# EAGLE design main_bottom (EAGLE 9.6.2)
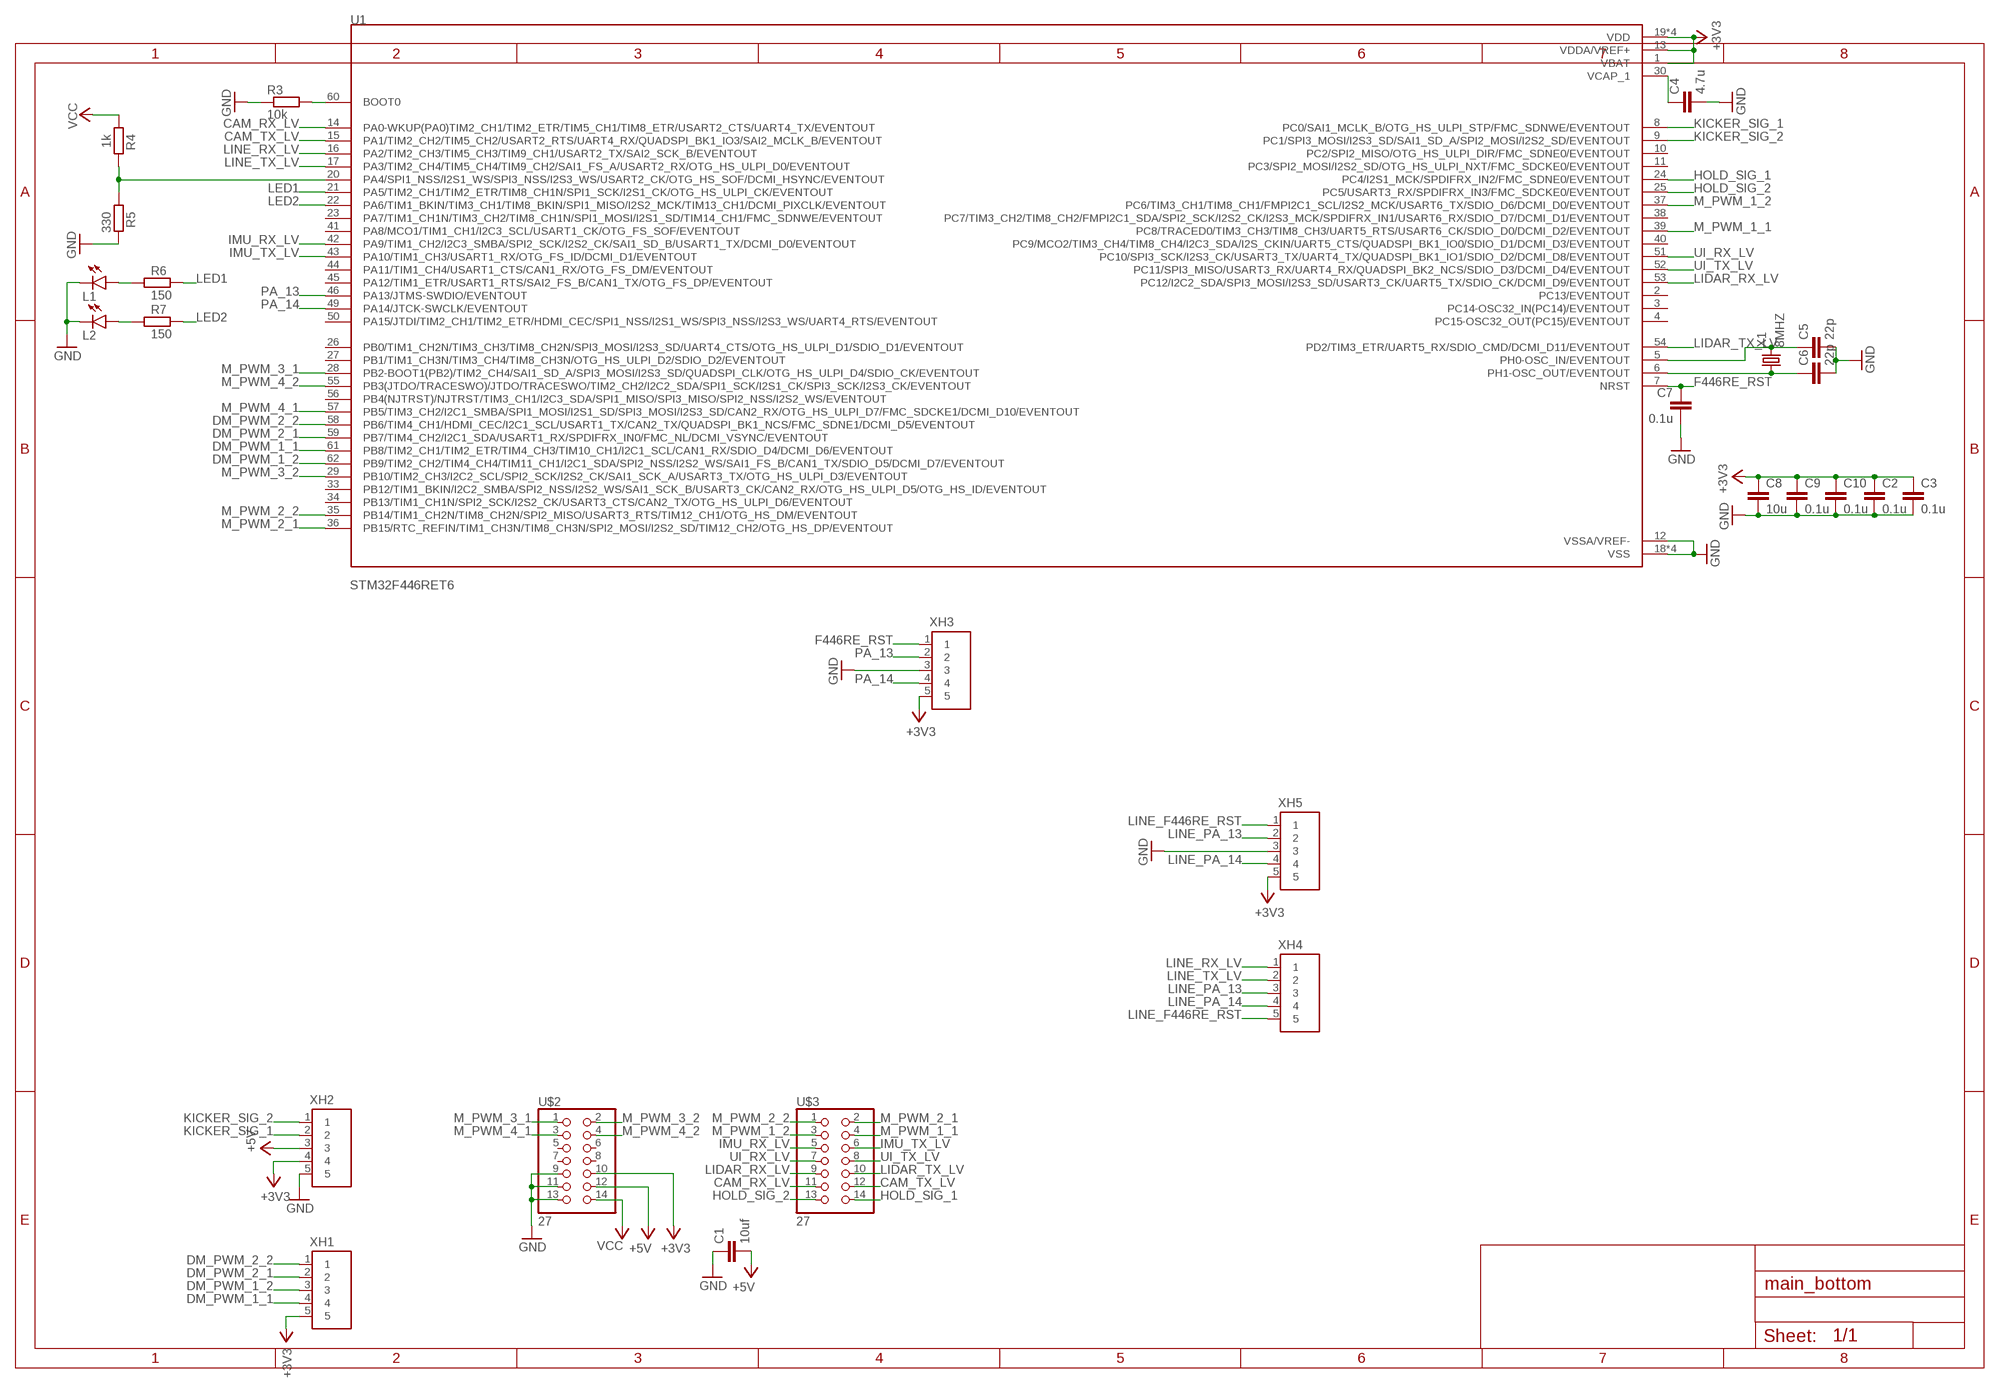
[diagram p0: schematic, sheet 1]

## Parts
C1  10uf  C-EUC0805  [C0805]
C2  0.1u  C-EUC0603  [C0603]
C3  0.1u  C-EUC0603  [C0603]
C4  4.7u  C-EUC0603  [C0603]
C5  22p  C-EUC0603  [C0603]
C6  22p  C-EUC0603  [C0603]
C7  0.1u  C-EUC0603  [C0603]
C8  10u  C-EUC0805  [C0805]
C9  0.1u  C-EUC0603  [C0603]
C10  0.1u  C-EUC0603  [C0603]
L1  SML-E12P8WT86  [LED_SML-LXFM0603SIC-TR]
L2  SML-E12P8WT86  [LED_SML-LXFM0603SIC-TR]
R3  10k  R-EU_R0603  [R0603]
R4  1k  R-EU_R0603  [R0603]
R5  330  R-EU_R0603  [R0603]
R6  150  R-EU_R0603  [R0603]
R7  150  R-EU_R0603  [R0603]
U1  STM32F446RET6  [QFP50P1200X1200X160-64N]
U$2  27  [2*7]
U$3  27  [2*7]
X1  8MHZ  16MHZ  [16MHZ]
XH1  S5B  [S5B]
XH2  S5B  [S5B]
XH3  S5B  [S5B]
XH4  S5B  [S5B]
XH5  S5B  [S5B]

## Nets
+3V3: C2.1 C3.1 C8.1 C9.1 C10.1 U1.1(VBAT) U1.13(VDDA/VREF+) U1.19(VDD) U1.32(VDD) U1.48(VDD) U1.64(VDD) U$2.10 XH1.5 XH2.4 XH3.5 XH5.5
+5V: C1.2 U$2.12 XH2.3
CAM_RX_LV: U1.14(PA0-WKUP(PA0)TIM2_CH1/TIM2_ETR/TIM5_CH1/TIM8_ETR/USART2_CTS/UART4_TX/EVENTOUT) U$3.11
CAM_TX_LV: U1.15(PA1/TIM2_CH2/TIM5_CH2/USART2_RTS/UART4_RX/QUADSPI_BK1_IO3/SAI2_MCLK_B/EVENTOUT) U$3.12
DM_PWM_1_1: U1.61(PB8/TIM2_CH1/TIM2_ETR/TIM4_CH3/TIM10_CH1/I2C1_SCL/CAN1_RX/SDIO_D4/DCMI_D6/EVENTOUT) XH1.4
DM_PWM_1_2: U1.62(PB9/TIM2_CH2/TIM4_CH4/TIM11_CH1/I2C1_SDA/SPI2_NSS/I2S2_WS/SAI1_FS_B/CAN1_TX/SDIO_D5/DCMI_D7/EVENTOUT) XH1.3
DM_PWM_2_1: U1.59(PB7/TIM4_CH2/I2C1_SDA/USART1_RX/SPDIFRX_IN0/FMC_NL/DCMI_VSYNC/EVENTOUT) XH1.2
DM_PWM_2_2: U1.58(PB6/TIM4_CH1/HDMI_CEC/I2C1_SCL/USART1_TX/CAN2_TX/QUADSPI_BK1_NCS/FMC_SDNE1/DCMI_D5/EVENTOUT) XH1.1
F446RE_RST: C7.1 U1.7(NRST) XH3.1
GND: C1.1 C2.2 C3.2 C4.2 C5.2 C6.2 C7.2 C8.2 C9.2 C10.2 L1.C L2.C R3.1 R5.2 U1.12(VSSA/VREF-) U1.18(VSS) U1.31(VSS) U1.47(VSS) U1.63(VSS) U$2.9 U$2.11 U$2.13 XH2.5 XH3.3 XH5.3
HOLD_SIG_1: U1.24(PC4/I2S1_MCK/SPDIFRX_IN2/FMC_SDNE0/EVENTOUT) U$3.14
HOLD_SIG_2: U1.25(PC5/USART3_RX/SPDIFRX_IN3/FMC_SDCKE0/EVENTOUT) U$3.13
IMU_RX_LV: U1.42(PA9/TIM1_CH2/I2C3_SMBA/SPI2_SCK/I2S2_CK/SAI1_SD_B/USART1_TX/DCMI_D0/EVENTOUT) U$3.5
IMU_TX_LV: U1.43(PA10/TIM1_CH3/USART1_RX/OTG_FS_ID/DCMI_D1/EVENTOUT) U$3.6
KICKER_SIG_1: U1.8(PC0/SAI1_MCLK_B/OTG_HS_ULPI_STP/FMC_SDNWE/EVENTOUT) XH2.2
KICKER_SIG_2: U1.9(PC1/SPI3_MOSI/I2S3_SD/SAI1_SD_A/SPI2_MOSI/I2S2_SD/EVENTOUT) XH2.1
LED1: R6.2 U1.21(PA5/TIM2_CH1/TIM2_ETR/TIM8_CH1N/SPI1_SCK/I2S1_CK/OTG_HS_ULPI_CK/EVENTOUT)
LED2: R7.2 U1.22(PA6/TIM1_BKIN/TIM3_CH1/TIM8_BKIN/SPI1_MISO/I2S2_MCK/TIM13_CH1/DCMI_PIXCLK/EVENTOUT)
LIDAR_RX_LV: U1.53(PC12/I2C2_SDA/SPI3_MOSI/I2S3_SD/USART3_CK/UART5_TX/SDIO_CK/DCMI_D9/EVENTOUT) U$3.9
LIDAR_TX_LV: U1.54(PD2/TIM3_ETR/UART5_RX/SDIO_CMD/DCMI_D11/EVENTOUT) U$3.10
LINE_F446RE_RST: XH4.5 XH5.1
LINE_PA_13: XH4.3 XH5.2
LINE_PA_14: XH4.4 XH5.4
LINE_RX_LV: U1.16(PA2/TIM2_CH3/TIM5_CH3/TIM9_CH1/USART2_TX/SAI2_SCK_B/EVENTOUT) XH4.1
LINE_TX_LV: U1.17(PA3/TIM2_CH4/TIM5_CH4/TIM9_CH2/SAI1_FS_A/USART2_RX/OTG_HS_ULPI_D0/EVENTOUT) XH4.2
M_PWM_1_1: U1.39(PC8/TRACED0/TIM3_CH3/TIM8_CH3/UART5_RTS/USART6_CK/SDIO_D0/DCMI_D2/EVENTOUT) U$3.4
M_PWM_1_2: U1.37(PC6/TIM3_CH1/TIM8_CH1/FMPI2C1_SCL/I2S2_MCK/USART6_TX/SDIO_D6/DCMI_D0/EVENTOUT) U$3.3
M_PWM_2_1: U1.36(PB15/RTC_REFIN/TIM1_CH3N/TIM8_CH3N/SPI2_MOSI/I2S2_SD/TIM12_CH2/OTG_HS_DP/EVENTOUT) U$3.2
M_PWM_2_2: U1.35(PB14/TIM1_CH2N/TIM8_CH2N/SPI2_MISO/USART3_RTS/TIM12_CH1/OTG_HS_DM/EVENTOUT) U$3.1
M_PWM_3_1: U1.28(PB2-BOOT1(PB2)/TIM2_CH4/SAI1_SD_A/SPI3_MOSI/I2S3_SD/QUADSPI_CLK/OTG_HS_ULPI_D4/SDIO_CK/EVENTOUT) U$2.1
M_PWM_3_2: U1.29(PB10/TIM2_CH3/I2C2_SCL/SPI2_SCK/I2S2_CK/SAI1_SCK_A/USART3_TX/OTG_HS_ULPI_D3/EVENTOUT) U$2.2
M_PWM_4_1: U1.57(PB5/TIM3_CH2/I2C1_SMBA/SPI1_MOSI/I2S1_SD/SPI3_MOSI/I2S3_SD/CAN2_RX/OTG_HS_ULPI_D7/FMC_SDCKE1/DCMI_D10/EVENTOUT) U$2.3
M_PWM_4_2: U1.55(PB3(JTDO/TRACESWO)/JTDO/TRACESWO/TIM2_CH2/I2C2_SDA/SPI1_SCK/I2S1_CK/SPI3_SCK/I2S3_CK/EVENTOUT) U$2.4
N$5: C4.1 U1.30(VCAP_1)
N$7: R3.2 U1.60(BOOT0)
N$8: C5.1 U1.5(PH0-OSC_IN/EVENTOUT) X1.P$2
N$10: C6.1 U1.6(PH1-OSC_OUT/EVENTOUT) X1.P$1
N$13: L2.A R7.1
N$14: L1.A R6.1
PA_13: U1.46(PA13/JTMS-SWDIO/EVENTOUT) XH3.2
PA_14: U1.49(PA14/JTCK-SWCLK/EVENTOUT) XH3.4
UI_RX_LV: U1.51(PC10/SPI3_SCK/I2S3_CK/USART3_TX/UART4_TX/QUADSPI_BK1_IO1/SDIO_D2/DCMI_D8/EVENTOUT) U$3.7
UI_TX_LV: U1.52(PC11/SPI3_MISO/USART3_RX/UART4_RX/QUADSPI_BK2_NCS/SDIO_D3/DCMI_D4/EVENTOUT) U$3.8
VCC: R4.1 U$2.14
VCC_SIG: R4.2 R5.1 U1.20(PA4/SPI1_NSS/I2S1_WS/SPI3_NSS/I2S3_WS/USART2_CK/OTG_HS_SOF/DCMI_HSYNC/EVENTOUT)
Unconnected: U1.2(PC13/EVENTOUT) U1.3(PC14-OSC32_IN(PC14)/EVENTOUT) U1.4(PC15-OSC32_OUT(PC15)/EVENTOUT) U1.10(PC2/SPI2_MISO/OTG_HS_ULPI_DIR/FMC_SDNE0/EVENTOUT) U1.11(PC3/SPI2_MOSI/I2S2_SD/OTG_HS_ULPI_NXT/FMC_SDCKE0/EVENTOUT) U1.23(PA7/TIM1_CH1N/TIM3_CH2/TIM8_CH1N/SPI1_MOSI/I2S1_SD/TIM14_CH1/FMC_SDNWE/EVENTOUT) U1.26(PB0/TIM1_CH2N/TIM3_CH3/TIM8_CH2N/SPI3_MOSI/I2S3_SD/UART4_CTS/OTG_HS_ULPI_D1/SDIO_D1/EVENTOUT) U1.27(PB1/TIM1_CH3N/TIM3_CH4/TIM8_CH3N/OTG_HS_ULPI_D2/SDIO_D2/EVENTOUT) U1.33(PB12/TIM1_BKIN/I2C2_SMBA/SPI2_NSS/I2S2_WS/SAI1_SCK_B/USART3_CK/CAN2_RX/OTG_HS_ULPI_D5/OTG_HS_ID/EVENTOUT) U1.34(PB13/TIM1_CH1N/SPI2_SCK/I2S2_CK/USART3_CTS/CAN2_TX/OTG_HS_ULPI_D6/EVENTOUT) U1.38(PC7/TIM3_CH2/TIM8_CH2/FMPI2C1_SDA/SPI2_SCK/I2S2_CK/I2S3_MCK/SPDIFRX_IN1/USART6_RX/SDIO_D7/DCMI_D1/EVENTOUT) U1.40(PC9/MCO2/TIM3_CH4/TIM8_CH4/I2C3_SDA/I2S_CKIN/UART5_CTS/QUADSPI_BK1_IO0/SDIO_D1/DCMI_D3/EVENTOUT) U1.41(PA8/MCO1/TIM1_CH1/I2C3_SCL/USART1_CK/OTG_FS_SOF/EVENTOUT) U1.44(PA11/TIM1_CH4/USART1_CTS/CAN1_RX/OTG_FS_DM/EVENTOUT) U1.45(PA12/TIM1_ETR/USART1_RTS/SAI2_FS_B/CAN1_TX/OTG_FS_DP/EVENTOUT) U1.50(PA15/JTDI/TIM2_CH1/TIM2_ETR/HDMI_CEC/SPI1_NSS/I2S1_WS/SPI3_NSS/I2S3_WS/UART4_RTS/EVENTOUT) U1.56(PB4(NJTRST)/NJTRST/TIM3_CH1/I2C3_SDA/SPI1_MISO/SPI3_MISO/SPI2_NSS/I2S2_WS/EVENTOUT) U$2.5 U$2.6 U$2.7 U$2.8

## Library data of the parts
C1-C10 = rcl:C-EU: CAPACITOR, European symbol; SPICEPREFIX: C
L1 L2 = LED:SML-E12P8WT86
R3-R7 = rcl:R-EU_: RESISTOR, European symbol; SPICEPREFIX: R
U1 = STM32F446RET6:STM32F446RET6: MCU 32-Bit STM32 ARM Cortex M4 RISC 512KB Flash 2.5V/3.3V 64-Pin LQFP Tray Check availability <https://pricing.snapeda.com/parts/STM32F446RET6/STMicroelectronics/view-part?ref=eda>; AVAILABILITY: In Stock; DESCRIPTION: ARM® Cortex®-M4 STM32F4 Microcontroller IC 32-Bit Single-Core 180MHz 512KB (512K x 8) FLASH 64-LQFP (10x10); MF: STMicroelectronics; MP: STM32F446RET6; PACKAGE: LQFP-64 STMicroelectronics; PRICE: None; PURCHASE-URL: https://pricing.snapeda.com/search/part/STM32F446RET6/?ref=eda
U$2 U$3 = pin_socket:2*7
X1 = crystal:16MHZ
XH1-XH5 = XH:S5B

## Board
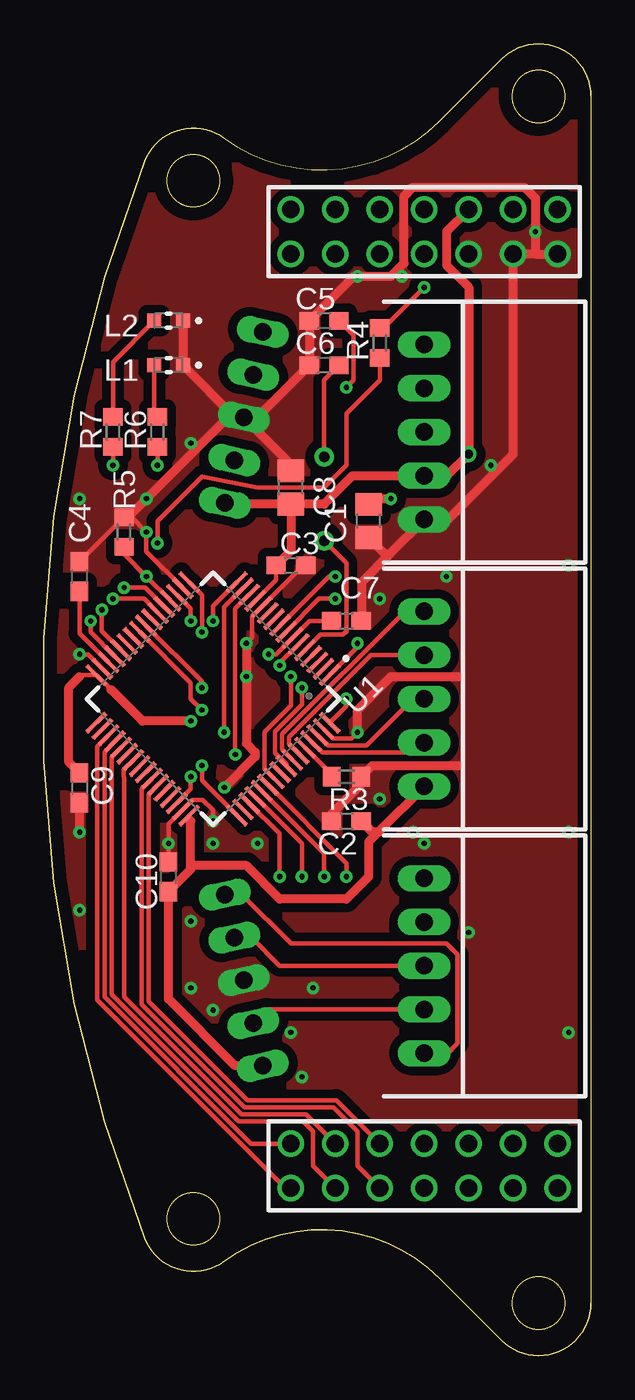
[diagram p1: board, top side]
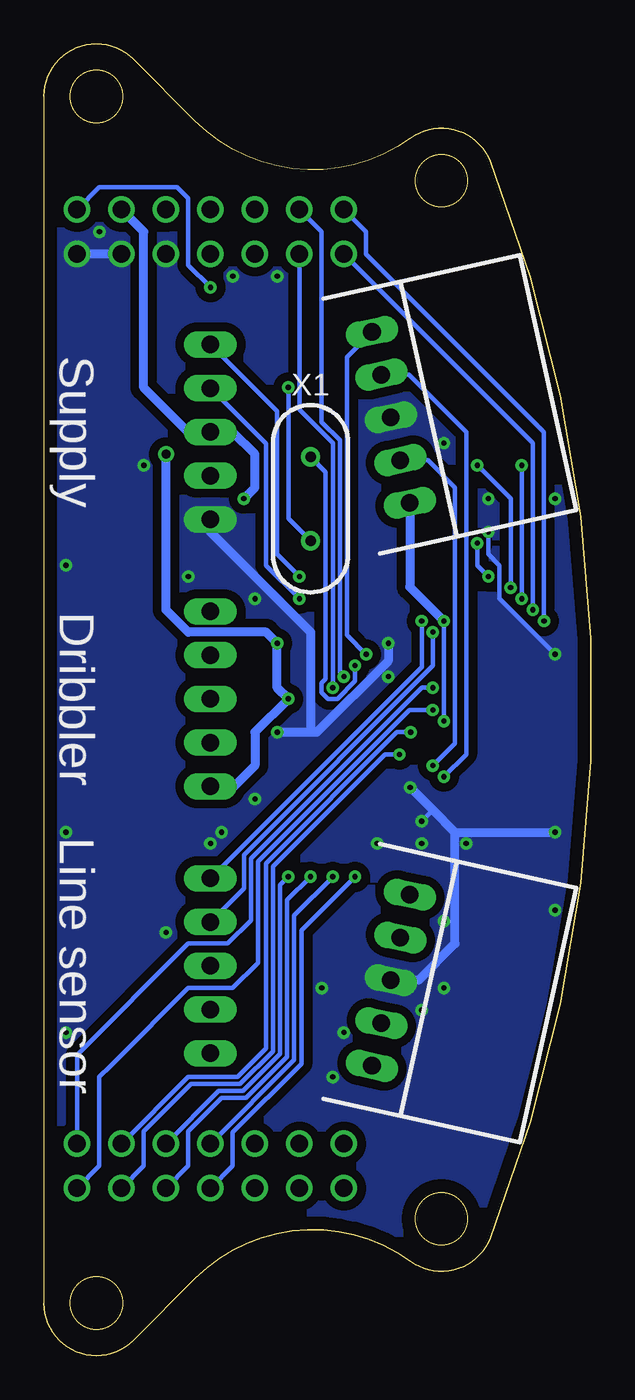
[diagram p2: board, bottom side, seen from below]

Size 31.26 x 74.91 mm. Coordinates in mm from the lower left corner, seen from the top.
Outline: 10.31,69.53 arc104 5.75,68.19
Outline: 5.75,68.19 arc43 5.75,6.72
Outline: 5.75,6.72 arc104 10.31,5.39
Outline: 10.31,5.39 arc-81 22.6,4.41
Outline: 22.6,4.41 26.14,0.88
Outline: 26.14,0.88 arc135 31.26,3
Outline: 31.26,71.91 arc135 26.14,74.03
Outline: 22.6,4.41 arc81 10.31,5.39
Outline: 10.31,5.39 arc-104 5.75,6.72
Outline: 5.75,6.72 arc-43 5.75,68.19
Outline: 5.75,68.19 arc-104 10.31,69.53
Outline: 10.31,69.53 arc81 22.6,70.5 26.14,74.03
Outline: 26.14,74.03 arc-135 31.26,71.91
Outline: 31.26,71.91 31.26,3
Outline: 31.26,3 arc-135 26.14,0.88
Outline: circle at 8.55,7.82 radius 1.5
Outline: circle at 28.26,71.91 radius 1.5
Outline: circle at 8.55,67.1 radius 1.5
Outline: circle at 28.26,3 radius 1.5
Copper layers (1*16): Top 0.035mm / dielectric 1.5mm / Bottom 0.035mm
Design rules "my *": minimum track width 6mil, minimum drill 0.3mm, track to track 6mil, track to pad 6mil, pad to pad 6mil, via to via 6mil, smd to smd 6mil, copper to edge 30mil, drill to drill 6mil, minimum pad ring 10mil, minimum via ring 8mil, stop-mask expansion 4mil, vias tented up to drill 0mil, thermal gap 10mil

### Footprints (pad centres in the part's own frame; a part is rotated, then mirrored left to right if it is on the bottom)
C0805 = smd 1.3 x 1.5: 1 -0.95,0; 2 0.95,0
C0603 = smd 1.1 x 1: 1 -0.85,0; 2 0.85,0
LED_SML-LXFM0603SIC-TR = smd 0.8 x 0.8: A 0.825,0; C -0.825,0
R0603 = smd 1 x 1.1: 1 -0.85,0; 2 0.85,0
QFP50P1200X1200X160-64N = smd 1.56 x 0.28: 1 -5.68,3.75; 2 -5.68,3.25; 3 -5.68,2.75; 4 -5.68,2.25; 5 -5.68,1.75; 6 -5.68,1.25; 7 -5.68,0.75; 8 -5.68,0.25; 9 -5.68,-0.25; 10 -5.68,-0.75; 11 -5.68,-1.25; 12 -5.68,-1.75; 13 -5.68,-2.25; 14 -5.68,-2.75; 15 -5.68,-3.25; 16 -5.68,-3.75; 33 5.68,-3.75; 34 5.68,-3.25; 35 5.68,-2.75; 36 5.68,-2.25; 37 5.68,-1.75; 38 5.68,-1.25; 39 5.68,-0.75; 40 5.68,-0.25; 41 5.68,0.25; 42 5.68,0.75; 43 5.68,1.25; 44 5.68,1.75; 45 5.68,2.25; 46 5.68,2.75; 47 5.68,3.25; 48 5.68,3.75 | smd 0.28 x 1.56: 17 -3.75,-5.68; 18 -3.25,-5.68; 19 -2.75,-5.68; 20 -2.25,-5.68; 21 -1.75,-5.68; 22 -1.25,-5.68; 23 -0.75,-5.68; 24 -0.25,-5.68; 25 0.25,-5.68; 26 0.75,-5.68; 27 1.25,-5.68; 28 1.75,-5.68; 29 2.25,-5.68; 30 2.75,-5.68; 31 3.25,-5.68; 32 3.75,-5.68; 49 3.75,5.68; 50 3.25,5.68; 51 2.75,5.68; 52 2.25,5.68; 53 1.75,5.68; 54 1.25,5.68; 55 0.75,5.68; 56 0.25,5.68; 57 -0.25,5.68; 58 -0.75,5.68; 59 -1.25,5.68; 60 -1.75,5.68; 61 -2.25,5.68; 62 -2.75,5.68; 63 -3.25,5.68; 64 -3.75,5.68
2*7 = drill 1: 1 -1.27,7.62; 2 1.27,7.62; 3 -1.27,5.08; 4 1.27,5.08; 5 -1.27,2.54; 6 1.27,2.54; 7 -1.27,0; 8 1.27,0; 9 -1.27,-2.54; 10 1.27,-2.54; 11 -1.27,-5.08; 12 1.27,-5.08; 13 -1.27,-7.62; 14 1.27,-7.62
16MHZ = drill 0.6: P$1 -2.4,0; P$2 2.4,0
S5B = drill 1 long: 1 0,5; 2 0,2.5; 3 0,0; 4 0,-2.5; 5 0,-5

### Placement (x,y rotation side)
C1  18.56,47.67 90 top
C2  17.29,30.52 180 top
C3  14.11,45.13 0 top
C4  2.05,44.49 90 top
C5  16.02,59.1 180 top
C6  16.02,56.56 180 top
C7  17.29,41.95 0 top
C8  14.11,49.57 90 top
C9  2.05,32.43 270 top
C10  7.13,27.35 90 top
L1  7.13,56.56 180 top
L2  7.13,59.1 180 top
R3  17.29,33.06 180 top
R4  19.19,57.83 270 top
R5  4.59,47.03 90 top
R6  6.49,52.75 270 top
R7  3.95,52.75 270 top
U1  9.67,37.51 225 top
U$2  21.73,64.18 90 top
U$3  21.73,10.84 90 top
X1  16.02,48.94 270 bottom
XH1  21.73,37.51 0 top
XH2  21.73,52.75 0 top
XH3  11.43,53.58 12.5 bottom
XH4  21.73,22.27 0 top
XH5  11.43,21.44 347.5 bottom

### Tracks (layer width: path | path; a pad name or v marks a point on that pad's centre or on a via)
+3V3  (via drill 0.3, 0.5)
  Top 0.25: U1.1 17.92,40.46 v17.92,40.68 | v17.29,37.51 17.29,37.09 U1.64 | U1.19 8.4,42.67 v8.4,41.95 | 3.84,38.03 U1.32 2.14,38.87 2.05,38.78 | C10.1 7.13,26.08 | 8.4,30.52 8.4,30.74 U1.48 | U1.13 13.26,44.28 C3.1
  Top 0.5: U$2.10 23,64.18 23,62.27 24.27,61 v24.27,51.48 23.04,50.25 XH2.4 17.64,50.25 16.02,48.62 C8.1 | C8.1 10.42,48.62 XH3.5 | C9.1 1.43,33.9 1.43,38.16 2.05,38.78 | v8.4,36.24 5.63,36.24 3.84,38.03 | XH5.5 10.94,16.56 10.94,16.55 7.13,20.36 7.13,26.08 | C10.1 8.4,27.77 8.4,27.98 | 8.4,27.98 8.4,30.52 | XH1.5 19.15,29.93 | 19.15,29.93 18.56,29.33 18.56,27.35 17.29,26.08 13.48,26.08 11.57,27.98 8.4,27.98 | C2.1 18.73,29.93 19.15,29.93 | C8.1 14.11,45.98 C3.1
  Bottom 0.25: v8.4,41.95 v8.4,36.24
  Bottom 0.5: v24.27,51.48 24.27,42.59 23,41.32 18.55,41.32 v17.92,40.68 17.92,38.14 v17.29,37.51 19.19,35.6 19.19,33.7 20.46,32.43 21.65,32.43 XH1.5 | XH3.5 10.35,43.9 v8.4,41.95
+5V  (via drill 0.3)
  Top 0.5: C1.2 18.88,48.94 v19.83,48.94
  Bottom 0.5: U$2.12 25.54,64.18 25.54,55.29 23,52.75 XH2.3 20.46,52.75 19.19,51.48 19.19,49.57 v19.83,48.94
CAM_RX_LV  (via drill 0.3)
  Top 0.25: U1.14 10.94,42.67 v10.94,34.33
  Bottom 0.25: U$3.11 25.54,10.84 25.54,12.81 22.84,15.52 20.03,15.52 18.16,17.39 18.16,27.95 11.77,34.33 v10.94,34.33
CAM_TX_LV  (via drill 0.3)
  Top 0.25: U1.15 10.3,42.74 v10.3,35.6
  Bottom 0.25: v10.3,35.6 11.07,35.6 18.56,28.11 18.56,17.56 20.2,15.92 23,15.92 U$3.12
DM_PWM_1_1
  Top 0.25: U1.61 15.92,34.44 21.16,34.44 XH1.4
DM_PWM_1_2
  Top 0.25: XH1.3 21.1,37.51 18.43,34.84 16.22,34.84 U1.62
DM_PWM_2_1
  Top 0.25: XH1.2 18.7,40.01 14.02,35.33 14.02,34.92 U1.59
DM_PWM_2_2
  Top 0.25: U1.58 13.62,34.62 13.62,35.49 20.64,42.51 XH1.1
F446RE_RST  (via drill 0.3)
  Top 0.25: C7.1 15.17,41.95 U1.7 13.27,40.05 v12.84,40.05
  Bottom 0.25: XH3.1 13.94,57.03 13.94,41.15 v12.84,40.05
GND  (via drill 0.3)
  Top 0.25: U1.63 16.53,35.24 17.56,35.24 v17.92,35.6 | C4.2 4.48,47.78 R5.2 5.01,47.88 v5.86,47.03 5.86,45.91 U1.18 | v11.57,40.68 11.9,41.01 11.9,42.22 U1.12 14.81,45.13 C3.2 | U1.31 2.53,40.05 v2.05,40.05 | C10.2 7.13,30.37 U1.47 8.49,31.74 9.09,31.74 9.67,31.16 v9.67,30.52
  Top 0.5: 19.79,45.8 XH2.5 23.08,47.75 26.81,51.48 U$2.11 28.08,62.91 | 19.79,45.8 18.14,44.15 C7.2 | 28.08,62.91 28.08,66.08 27.45,66.72 21.1,66.72 20.58,66.2 20.58,62.39 19.83,61.64 v17.92,61.64 17.71,61.64 C5.2 C6.2 12.19,53.58 XH3.3 | 28.08,62.91 U$2.13 | XH3.3 14.11,50.89 C8.2 | XH3.3 10.5,53.58 4.7,47.78 4.48,47.78 | v11.57,40.68 11.57,34.97 12.08,34.46 12.08,34.21 v10.32,32.44 | v2.05,29.89 C9.2 | L2.C L1.C 10.93,53.58 XH3.3 | C1.1 19.47,45.8 19.79,45.8 | C2.2 16.44,30.94 18.14,32.64 R3.1 18.77,33.7 23.64,33.7 | 23.64,38.78 19.83,38.78 17.92,36.87 v17.92,35.6
  Bottom 0.25: v2.05,40.05 5.22,43.22 5.22,45.13 5.86,45.76 v5.86,47.03 | v9.67,30.52 9.03,31.16
  Bottom 0.5: U$2.11 U$2.13 | v11.57,40.68 11.57,39.68 15.65,35.6 16.02,35.6 | v17.92,35.6 16.02,35.6 | XH2.5 21.73,47.03 16.02,41.32 16.02,35.6 | v10.32,32.44 9.03,31.16 7.76,29.89 | XH5.3 9.86,21.44 7.76,23.54 7.76,29.89 | 7.76,29.89 v2.05,29.89
  other vias: 20.46,61.64 8.4,52.11 12.21,29.25 9.67,29.25 9.67,19.73 8.4,21 14.11,18.46 14.75,15.92 29.99,18.46 24.27,24.17 21.1,29.89 19.19,31.79 23,44.49 19.19,43.22 25.54,50.84 28.08,64.18 8.4,24.81 2.05,25.44 7.13,29.25 5.86,48.94 29.99,45.13 29.99,29.89 15.38,21 11.57,38.78 2.05,48.94 21.73,29.25
  pour Bottom (isolate 0.5, no thermals): -5.57,80.69 35.07,80.69 35.07,-3.13 -5.57,-3.13
  pour Top (isolate 0.5, no thermals): -4.3,79.42 32.53,79.42 32.53,-0.59 -4.3,-0.59
HOLD_SIG_1  (via drill 0.3)
  Top 0.25: U1.24 9.03,38.5 v9.03,38.14
  Bottom 0.25: v9.03,38.14 9.67,38.14 19.43,28.38 19.43,24.86 20.75,23.54 23,23.54 29.35,17.19 U$3.14
HOLD_SIG_2  (via drill 0.3)
  Top 0.25: U1.25 8.4,38.42 8.4,37.51 v9.03,36.87
  Bottom 0.25: v9.03,36.87 10.37,36.87 19.02,28.22 19.02,22.44 20.46,21 23,21 27.13,16.87 27.45,16.55 28.08,15.92 28.08,10.84 U$3.13
IMU_RX_LV
  Top 0.25: U$3.5 17.92,10.84 17.92,12.81 16.55,14.18 11.47,14.18 5.59,20.06 5.59,32.37 U1.42
IMU_TX_LV
  Top 0.25: U1.43 5.99,32.06 5.99,20.23 11.64,14.58 16.72,14.58 U$3.6
KICKER_SIG_1  (via drill 0.3)
  Top 0.25: v16.65,43.22 15.74,43.22 U1.8
  Bottom 0.25: XH2.2 18.56,52.07 18.56,45.13 v16.65,43.22
KICKER_SIG_2  (via drill 0.3)
  Top 0.25: U1.9 16.3,44.49 v16.65,44.49
  Bottom 0.25: v16.65,44.49 17.92,45.76 17.92,53.94 XH2.1
LED1  (via drill 0.3)
  Top 0.25: U1.21 5.79,43.86 v4.59,43.86 | v6.49,50.84 R6.2
  Bottom 0.25: v4.59,43.86 4.59,48.94 v6.49,50.84
LED2  (via drill 0.3)
  Top 0.25: R7.2 v3.95,50.84 | v3.95,43.22 5.72,43.22 U1.22
  Bottom 0.25: v3.95,50.84 v3.95,43.22
LIDAR_RX_LV  (via drill 0.3)
  Top 0.25: U1.53 16.02,28.68 v16.02,27.35
  Bottom 0.25: U$3.9 23,10.84 23,12.81 21.1,14.71 19.7,14.71 17.35,17.06 17.35,26.01 v16.02,27.35
LIDAR_TX_LV  (via drill 0.3)
  Top 0.25: U1.54 17.29,28.12 v17.29,27.35
  Bottom 0.25: v17.29,27.35 17.75,26.88 17.75,17.23 19.87,15.11 21.27,15.11 U$3.10
LINE_F446RE_RST
  Top 0.25: XH5.1 11.33,26.32 14.11,23.54 23,23.54 23.64,22.9 23.64,17.82 23,17.19 21.81,17.19 XH4.5
LINE_PA_13
  Top 0.25: XH4.3 13.48,22.27 11.87,23.88 XH5.2
LINE_PA_14
  Top 0.25: XH5.4 12.74,19.77 XH4.4
LINE_RX_LV  (via drill 0.3)
  Top 0.25: U1.16 9.67,42.81 v9.67,41.95
  Bottom 0.25: XH4.1 9.67,39.33 v9.67,41.95
LINE_TX_LV  (via drill 0.3)
  Top 0.25: U1.17 9.03,43.45 v9.03,41.32
  Bottom 0.25: XH4.2 19.83,26.67 19.83,28.6 9.03,39.4 v9.03,41.32
M_PWM_1_1
  Top 0.25: U1.39 4.58,33.48 4.58,33.07 4.59,33.06 4.59,20.49 11.3,13.78 14.98,13.78 U$3.4
M_PWM_1_2
  Top 0.25: U$3.3 15.38,10.84 15.38,12.81 14.81,13.38 11.14,13.38 3.87,20.64 3.87,34.18 U1.37
M_PWM_2_1
  Top 0.25: U$3.2 11.84,12.11 3.47,20.48 3.47,34.49 U1.36
M_PWM_2_2
  Top 0.25: U1.35 3.06,34.79 3.06,20.31 11.67,11.71 13.81,9.57 U$3.1
M_PWM_3_1  (via drill 0.3)
  Top 0.25: v3.32,42.59 3.32,41.38 U1.28
  Bottom 0.25: U$2.1 3.32,52.11 v3.32,42.59
M_PWM_3_2  (via drill 0.3)
  Top 0.25: U1.29 2.68,41.31 v2.68,41.95
  Bottom 0.25: v2.68,41.95 2.68,52.75 12.84,62.91 12.84,64.18 U$2.2
M_PWM_4_1  (via drill 0.3)
  Top 0.25: U1.57 13.86,33.78 13.22,34.43 13.22,35.66 14.75,37.19 v14.75,38.14
  Bottom 0.25: v14.75,38.14 14.75,52.11 16.65,54.02 U$2.3
M_PWM_4_2  (via drill 0.3)
  Top 0.25: v14.11,38.78 14.11,37.12 12.61,35.62 12.61,33.51 U1.55
  Bottom 0.25: U$2.4 15.38,64.18 15.38,53.32 14.35,52.28 14.35,39.01 v14.11,38.78
N$5
  Top 0.25: C4.1 2.05,41.24 U1.30
N$7
  Top 0.25: U1.60 16.44,33.21 R3.2
N$8  (via drill 0.3)
  Top 0.25: X1.P$2 17.29,45.27 17.29,41.32 17.24,41.32 17.1,41.18 15.81,41.18 U1.5 | C5.1 17.69,58.27 17.69,55.69 v17.29,55.29
  Bottom 0.25: X1.P$2 17.29,47.81 v17.29,55.29
N$10  (via drill 0.3)
  Top 0.25: C6.1 16.02,55.71 X1.P$1 | U1.6 13.48,39.55 v13.48,39.41
  Bottom 0.25: v13.48,39.41 13.48,38.52 14.49,37.51 15.01,37.51 15.38,37.88 15.38,38.4 15.15,38.63 15.15,50.47 X1.P$1
N$13
  Top 0.25: R7.1 3.95,56.75 L2.A
N$14
  Top 0.25: L1.A 6.3,53.79 R6.1
PA_13  (via drill 0.3)
  Top 0.25: v8.4,33.06 8.4,32.35 U1.46
  Bottom 0.25: XH3.2 10.4,56.02 7.13,52.75 7.13,34.33 v8.4,33.06
PA_14  (via drill 0.3)
  Top 0.25: v9.03,33.7 9.03,32.84 U1.49
  Bottom 0.25: XH3.4 9.33,51.14 7.76,49.57 7.76,34.97 v9.03,33.7
UI_RX_LV  (via drill 0.3)
  Top 0.25: U1.51 13.48,29.81 v13.48,27.35
  Bottom 0.25: v13.48,27.35 16.55,24.28 16.55,16.66 20.46,12.74 20.46,10.84 U$3.7
UI_TX_LV  (via drill 0.3)
  Top 0.25: v14.75,27.35 14.75,29.25 U1.52
  Bottom 0.25: v14.75,27.35 16.95,25.15 16.95,16.89 U$3.8
VCC  (via drill 0.3)
  Top 0.25: v21.73,61 19.41,58.68 R4.1
  Bottom 0.25: U$2.14 28.08,66.72 23.64,66.72 23,66.08 23,62.27 v21.73,61
VCC_SIG  (via drill 0.3)
  Top 0.25: R5.1 4.59,45.77 v5.86,44.5 U1.20 | R4.2 19.19,55.71 17.29,53.8 17.29,50.84 16.02,49.57 12.21,49.57 9.03,50.21 6.49,47.67 v6.49,46.4
  Bottom 0.25: v6.49,46.4 6.49,45.13 v5.86,44.5

### Text on the board
bPlace: Supply | Dribbler | Line sensor